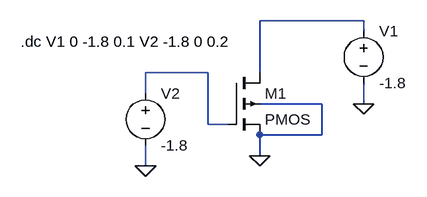
[diagram p0: schematic pmos_outputch1.asc]
pmos_outputch1.asc, the LTspice schematic file:
Version 4.1
SHEET 1 880 680
WIRE 368 48 208 48
WIRE 368 64 368 48
WIRE 128 128 32 128
WIRE 208 128 208 48
WIRE 32 160 32 128
WIRE 304 176 208 176
WIRE 368 176 368 144
WIRE 128 208 128 128
WIRE 160 208 128 208
WIRE 304 224 304 176
WIRE 304 224 208 224
WIRE 208 256 208 224
WIRE 32 272 32 240
FLAG 32 272 0
FLAG 208 256 0
FLAG 368 176 0
SYMBOL pmos4 160 128 R0
SYMATTR InstName M1
SYMATTR Value2 l=1080nm w=1080nm
SYMBOL voltage 368 48 R0
WINDOW 123 0 0 Left 0
WINDOW 39 0 0 Left 0
SYMATTR InstName V1
SYMATTR Value -1.8
SYMBOL voltage 32 144 R0
WINDOW 123 0 0 Left 0
WINDOW 39 0 0 Left 0
SYMATTR InstName V2
SYMATTR Value -1.8
TEXT -160 80 Left 2 !.dc V1 0 -1.8 0.1 V2 -1.8 0 0.2

The netlist it stands for:
* pmos_outputch1.asc
M1 N001 N002 0 0 PMOS l=1080nm w=1080nm
V1 N001 0 -1.8
V2 N002 0 -1.8
.model NMOS NMOS
.model PMOS PMOS
.lib standard.mos
.dc V1 0 -1.8 0.1 V2 -1.8 0 0.2
.backanno
.end